# Altium project high_voltage_controller.PrjPcb (part 1 of 5)
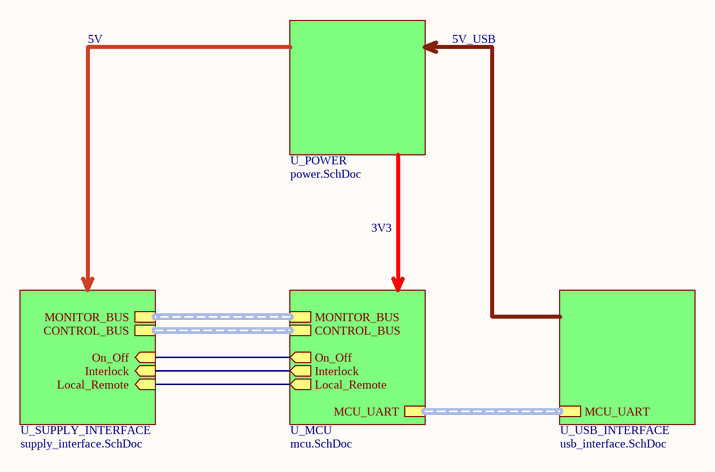
[diagram p0: high_voltage_controller.SchDoc]
5 sheets, 57 parts. Net scope: hierarchical (ports join the sheet entries above them; power ports are global).
Board file: high_voltage_controller.PcbDoc
Sheets:
  high_voltage_controller.SchDoc
    U_MCU = mcu.SchDoc
    U_SUPPLY_INTERFACE = supply_interface.SchDoc
    U_USB_INTERFACE = usb_interface.SchDoc
    U_POWER = power.SchDoc

## Sheet high_voltage_controller.SchDoc
size A4; SheetNumber: 1; SheetTotal: 5

### Sub-sheets
U_MCU = mcu.SchDoc: MONITOR_BUS (harness MONITOR_BUS), CONTROL_BUS (harness CONTROL_BUS), MCU_UART (harness MCU_UART), On_Off (out), Local_Remote (out), Interlock (out)
U_POWER = power.SchDoc: no entries
U_SUPPLY_INTERFACE = supply_interface.SchDoc: Local_Remote (in), Interlock (in), On_Off (in), MONITOR_BUS (harness MONITOR_BUS), CONTROL_BUS (harness CONTROL_BUS)
U_USB_INTERFACE = usb_interface.SchDoc: MCU_UART (harness MCU_UART)

### Nets
NetQ1_1: sheet U_MCU/Local_Remote, sheet U_SUPPLY_INTERFACE/Local_Remote
NetQ2_1: sheet U_MCU/Interlock, sheet U_SUPPLY_INTERFACE/Interlock
NetQ3_1: sheet U_MCU/On_Off, sheet U_SUPPLY_INTERFACE/On_Off

### Buses and harness runs
harness sheet U_MCU/CONTROL_BUS = sheet U_SUPPLY_INTERFACE/CONTROL_BUS
harness sheet U_MCU/MCU_UART = sheet U_USB_INTERFACE/MCU_UART
harness sheet U_MCU/MONITOR_BUS = sheet U_SUPPLY_INTERFACE/MONITOR_BUS

### Notes on the sheet
- 5V
- 5V_USB
- 3V3

## Sheet mcu.SchDoc
size A4; SheetNumber: 2; SheetTotal: 5
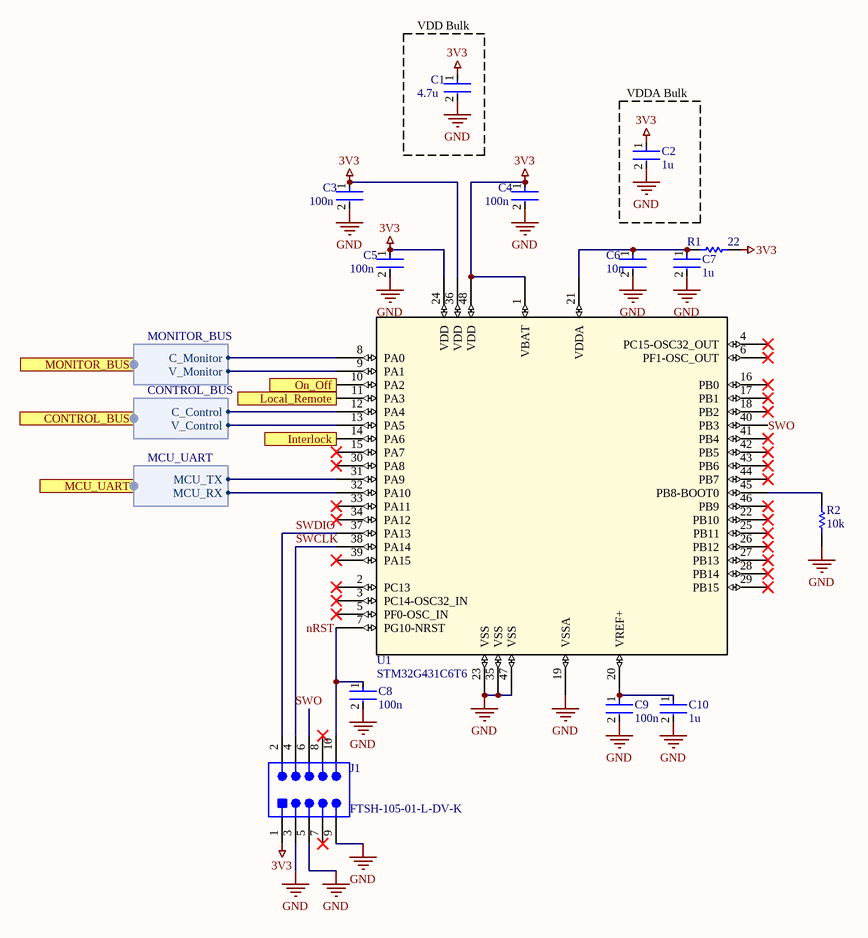
[diagram p1: mcu.SchDoc]

### Parts
C1  4.7u  [C_IM 0805]
C2  1u  [C_IM 0603]
C3  100n  [C_IM 0603]
C4  100n  [C_IM 0603]
C5  100n  [C_IM 0603]
C6  10n  [C_IM 0603]
C7  1u  [C_IM 0805]
C8  100n  [C_IM 0603]
C9  100n  [C_IM 0603]
C10  1u  [C_IM 0603]
J1  FTSH-105-01-L-DV-K  [FTSH-105-01-L-DV-K]
R1  22  [R_IM 0805]
R2  10k  [R_IM 0805]
U1  STM32G431C6T6  [LQFP48-7x7mm]

### Blocks framed on the sheet
VDD Bulk: C1
VDDA Bulk: C2

### Ports
CONTROL_BUS (harness CONTROL_BUS, see high_voltage_controller[2C], supply_interface[3C]), Interlock (out, see high_voltage_controller[2C], supply_interface[2A]), Local_Remote (out, see high_voltage_controller[2C], supply_interface[2A]), MCU_UART (harness MCU_UART, see high_voltage_controller[3C], usb_interface[1B]), MONITOR_BUS (harness MONITOR_BUS, see high_voltage_controller[2C], supply_interface[3B]), On_Off (out, see high_voltage_controller[2C], supply_interface[2B])

### Harnesses
MONITOR_BUS: C_Monitor, V_Monitor
CONTROL_BUS: C_Control, V_Control
MCU_UART: MCU_TX, MCU_RX

### Nets
3V3: C1.1 C2.1 C3.1 C4.1 C5.1 J1.1 R1.2 U1.1(VBAT) U1.24(VDD) U1.36(VDD) U1.48(VDD)
GND: C1.2 C2.2 C3.2 C4.2 C5.2 C6.2 C7.2 C8.2 C9.2 C10.2 J1.3 J1.5 J1.9 R2.1 U1.19(VSSA) U1.23(VSS) U1.35(VSS) U1.47(VSS)
nRST: C8.1 J1.10 U1.7(PG10-NRST)
SWCLK: J1.4 U1.38(PA14)
SWDIO: J1.2 U1.37(PA13)
SWO: J1.6 U1.40(PB3)
NetC6_1: C6.1 C7.1 R1.1 U1.21(VDDA)
NetC9_1: C9.1 C10.1 U1.20(VREF+)
NetQ1_1: U1.11(PA3) ; port Local_Remote
NetQ2_1: U1.14(PA6) ; port Interlock
NetQ3_1: U1.10(PA2) ; port On_Off
NetR2_2: R2.2 U1.45(PB8-BOOT0)
NetR3_1: U1.8(PA0) ; port MONITOR_BUS.C_Monitor
NetR5_2: U1.9(PA1) ; port MONITOR_BUS.V_Monitor
NetU1_12: U1.12(PA4) ; port CONTROL_BUS.C_Control
NetU1_13: U1.13(PA5) ; port CONTROL_BUS.V_Control
NetU1_31: U1.31(PA9) ; port MCU_UART.MCU_TX
NetU1_32: U1.32(PA10) ; port MCU_UART.MCU_RX

Not connected (* = marked no-connect by the designer): J1 7* 8*; U1 2(PC13)* 3(PC14-OSC32_IN)* 4(PC15-OSC32_OUT)* 5(PF0-OSC_IN)* 6(PF1-OSC_OUT)* 15(PA7)* 16(PB0)* 17(PB1)* 18(PB2)* 22(PB10)* 25(PB11)* 26(PB12)* 27(PB13)* 28(PB14)* 29(PB15)* 30(PA8)* 33(PA11)* 34(PA12)* 39(PA15)* 41(PB4)* 42(PB5)* 43(PB6)* 44(PB7)* 46(PB9)*